# Altium schematic sheet RS485.SchDoc
size A4; SheetNumber: 4; SheetTotal: 4
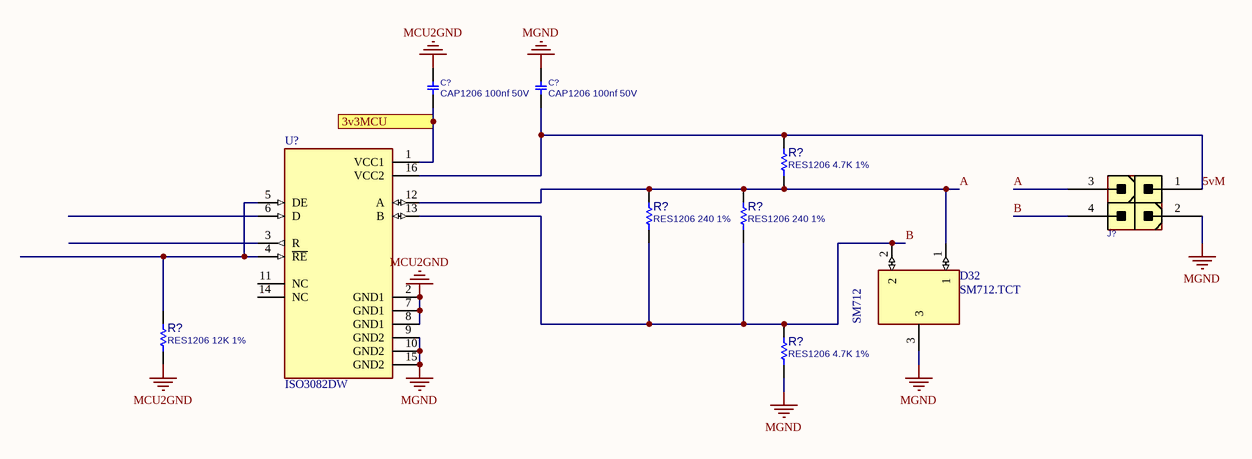
[diagram p0: RS485.SchDoc]

## Parts
(Parts that share a designator on the sheet are numbered #1, #2 ... from top to bottom, then left to right.)
C?#1  CAP1206 100nf 50V  [C1206]
C?#2  CAP1206 100nf 50V  [C1206]
D32  SM712.TCT  [SOT23]
J?  CONN_ATXPWR_4  [ATXPWR_4]  (value not drawn)
R?#1  RES1206 4.7K 1%  [R1206]
R?#2  RES1206 240 1%  [R1206]
R?#3  RES1206 240 1%  [R1206]
R?#4  RES1206 12K 1%  [R1206]
R?#5  RES1206 4.7K 1%  [R1206]
U?  ISO3082DW  [SOIC127P1030X265-16N]

## Ports
3v3MCU

## Nets
MCU2GND: C?#1.1 R?#4.1 U?.2(GND1) U?.7(GND1) U?.8(GND1)
MGND: C?#2.1 D32.3 J?.2 R?#5.1 U?.9(GND2) U?.10(GND2) U?.15(GND2)
3v3MCU: C?#1.2 U?.1(VCC1) ; port 3v3MCU
5vM: C?#2.2 J?.1 R?#1.2 U?.16(VCC2)
A: D32.1 J?.3 R?#1.1 R?#2.2 R?#3.2 U?.12(A)
B: D32.2 J?.4 R?#2.1 R?#3.1 R?#5.2 U?.13(B)
NetR?#4_2: R?#4.2 U?.4(~{RE}) U?.5(DE)

Not connected (* = marked no-connect by the designer): U? 3(R) 6(D) 11(NC) 14(NC)

## Notes on the sheet
- (in symbol SM712.TCT) SM712

## Library data of the parts
C?#1 C?#2 = CAP_SMD_MLCC_1206: CAP, MLCC; PARAM: -, -%; MANF_P#: MANF_PART#; PARAM2: -V; PRICE: 100= 1$; MANF: -; ASSEMBLY: ASSEMBLY
D32 = SM712.TCT: SM Series 12 V 400 W Asymmetrical TVS Diode for Extended Common-Mode - SOT-23; MF: Semtech Corporation; SnapEDA_Link: https://www.snapeda.com/parts/SM712.TCT/Semtech/view-part/?ref=snap; Package: SOT-23 Semtech; Value: *; MP: SM712.TCT; Check_prices: https://www.snapeda.com/parts/SM712.TCT/Semtech/view-part/?ref=eda
J? = CONN_ATXPWR_4: CONN, ATX POWER, 4 P; MANF: TE, Molex; MANF_P#: 4-1775099-0, 39281043; VALUE: CONN_ATXPWR_4; MountType: THD; PACKAGE: ATXPWR-4pin; Part Type: Conn.
R?#1-R?#5 = RES_SMD_1206: RESISTOR, SMD; PARAM: 1%, 0.25W; DESC: DESCRIPTION; DIST#: MOUSER; MANF_P#: -; MANF: -; ASSEMBLY: ASSEMBLY; PRICE: -; PARAM2: -
U? = ISO3082DW: 200-Kbps, half-duplex, 2.5-kVrms isolated RS-485 & RS-422 transceiver; MF: Texas Instruments; SnapEDA_Link: https://www.snapeda.com/parts/ISO3082DW/Texas+Instruments/view-part/?ref=snap; Package: SOIC-16 Texas Instruments; Value: *; MP: ISO3082DW; Check_prices: https://www.snapeda.com/parts/ISO3082DW/Texas+Instruments/view-part/?ref=eda